# Altium schematic sheet User.SchDoc
size A4
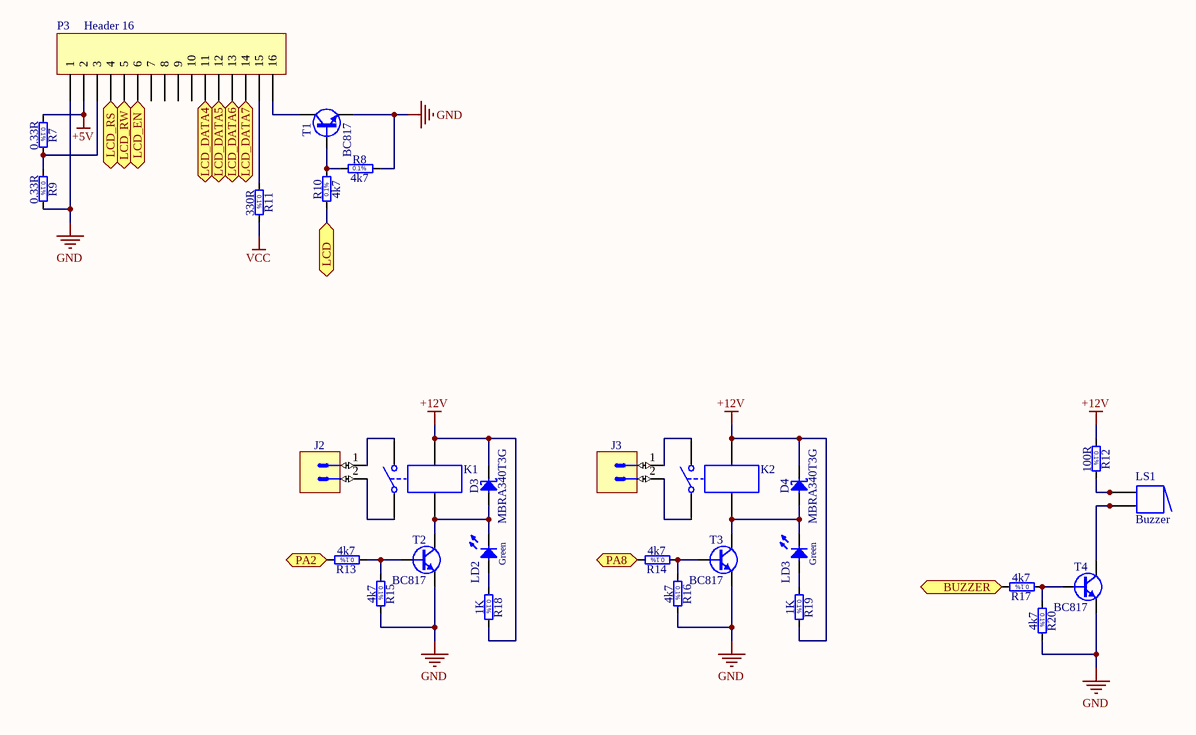
[diagram p0: User.SchDoc]

## Parts
D3  MBRA340T3G  [DIOM5226X220N]
D4  MBRA340T3G  [DIOM5226X220N]
J2  (no value)  [PHOENIX_1757242]
J3  (no value)  [PHOENIX_1757242]
K1  Relay-SPST  [REL_FINDER_32.22.X.XXX.X300]  (value not drawn)
K2  Relay-SPST  [REL_FINDER_32.22.X.XXX.X300]  (value not drawn)
LD2  Green  [LED_OSRAM_LGR971]  (value not drawn)
LD3  Green  [LED_OSRAM_LGR971]  (value not drawn)
LS1  Buzzer  [ABSM-1574]
P3  Header 16  [HDR1X16]
R7  0.33R  [RESC2012X60N]
R8  4k7  [RESC2012X60N]
R9  0.33R  [RESC2012X60N]
R10  4k7  [RESC2012X60N]
R11  330R  [RESC2012X60N]
R12  100R  [RESC2012X60N]
R13  4k7  [RESC2012X60N]
R14  4k7  [RESC2012X60N]
R15  4k7  [RESC2012X60N]
R16  4k7  [RESC2012X60N]
R17  4k7  [RESC2012X60N]
R18  1K  [RESC2012X60N]
R19  1K  [RESC2012X60N]
R20  4k7  [RESC2012X60N]
T1  BC817  [SOT95P230X110-3N]
T2  BC817  [SOT95P230X110-3N]
T3  BC817  [SOT95P230X110-3N]
T4  BC817  [SOT95P230X110-3N]

## Ports
BUZZER, LCD, LCD_DATA4, LCD_DATA5, LCD_DATA6, LCD_DATA7, LCD_EN, LCD_RS, LCD_RW, PA2, PA8

## Nets
+5V: P3.2 R7.1
+12V: D3.1(C) D4.1(C) K1.4 K2.4 R12.1 R18.2 R19.2
GND: P3.1 R8.2 R9.2 R15.2 R16.2 R20.2 T1.2(E) T2.2(E) T3.2(E) T4.2(E)
VCC: R11.2
BUZZER: R17.2 ; port BUZZER
LCD: R10.1 ; port LCD
LCD_DATA4: P3.11 ; port LCD_DATA4
LCD_DATA5: P3.12 ; port LCD_DATA5
LCD_DATA6: P3.13 ; port LCD_DATA6
LCD_DATA7: P3.14 ; port LCD_DATA7
LCD_EN: P3.6 ; port LCD_EN
LCD_RS: P3.4 ; port LCD_RS
LCD_RW: P3.5 ; port LCD_RW
PA2: R13.2 ; port PA2
PA8: R14.2 ; port PA8
NetD3_2: D3.2(A) K1.3 LD2.1(C) T2.3(C)
NetD4_2: D4.2(A) K2.3 LD3.1(C) T3.3(C)
NetJ2_1: J2.1 K1.2
NetJ2_2: J2.2 K1.1
NetJ3_1: J3.1 K2.2
NetJ3_2: J3.2 K2.1
NetLD2_2: LD2.2(A) R18.1
NetLD3_2: LD3.2(A) R19.1
NetLS1_1: LS1.1 LS1.1A R12.2
NetLS1_2: LS1.2 LS1.2A T4.3(C)
NetP3_3: P3.3 R7.2 R9.1
NetP3_15: P3.15 R11.1
NetP3_16: P3.16 T1.3(C)
NetR8_1: R8.1 R10.2 T1.1(B)
NetR13_1: R13.1 R15.1 T2.1(B)
NetR14_1: R14.1 R16.1 T3.1(B)
NetR17_1: R17.1 R20.1 T4.1(B)

Not connected (* = marked no-connect by the designer): P3 7 8 9 10

## Notes on the sheet
- (in symbol R0805_1K1_0.1%_0.1W_10PPM) 0.1%

## Library data of the parts
D3 D4 = MBRA340T3G: Schottky Diode; Part Description: Schottky Power Rectifier; Manufacturer: ON SEMICONDUCTOR; Voltage: 40V; Power: 3A; Table: Diodes; Part Number: MBRA340T3G; Component Kind: Standard; Component Type: Standard; Device: MBRA340T3G; PackageDescription: DO-214-AC/SMA Diode, Molded Body; 5.21mm L X 2.60mm W X 2.20mm H, IPC Medium Density; Manufacturer Part Number: MBRA340T3G; Pin Count: 2; Case: DO-214AC; Mounted: Yes; Socket: No; SMD: Yes; ComponentHeight: 2.2mm; HelpURL: \\cern.ch\dfs\Applications\Altium\Datasheets\MBRA340T3G.pdf; Author: CERN DEM JLC; CreateDate: 18.06.2012; LatestRevisionDate: 18.06.2012
J2 J3 = PHOENIX_1757242: Connector 2 Male; Part Description: 12A, 250V, Pitch 5.08mm, 2 Positions Header; Manufacturer: PHOENIX CONTACT; Manufacturer Part Number: 1757242 (MSTBA 2,5/ 2-G-5,08); Part Number: PHOENIX_1757242; Component Kind: Standard; Component Type: Standard; Pin Count: 2; Mounted: Yes; Socket: No; SMD: No; Status: None; ComponentHeight: 8.6mm; HelpURL: \\cern.ch\dfs\Applications\Altium\Datasheets\PHOENIX_1757242.pdf; Author: CERN DEM JLC; CreateDate: 10.02.2010; LatestRevisionDate: 26.04.2010; Table: PHOENIX
K1 K2 = Relay-SPST: Single-Pole Single-Throw Relay; pin to pad: 1>11 2>14 3>A1 4>A2; Published: 24-Mar-1999; LatestRevisionDate: 17-Jul-2002; LatestRevisionNote: Re-released for DXP Platform.; PackageReference: MODULE4; Publisher: Altium Limited
LD2 LD3 = LED_OSRAM_LGR971: LED Green 1C 2A; Part Description: Surface Mount Green LED (0805 Case); Manufacturer: OSRAM; Manufacturer Part Number: LGR971; Table: LEDs & Displays; Part Number: LED_OSRAM_LGR971; Component Kind: Standard; Component Type: Standard; Color: Green; PackageDescription: Green Chip LED, 2-Leads, Body 2.0x1.25mm, IPC Medium Density; Pin Count: 2; Case: 0805; Mounted: Yes; Socket: No; SMD: Yes; ComponentHeight: 0.9mm; HelpURL: \\cern.ch\dfs\Applications\Altium\Datasheets\LED_OSRAM_LGR971.pdf; Author: CERN DEM JLC; CreateDate: 28.01.2009; LatestRevisionDate: 17.03.2010
LS1 = Buzzer: Magnetic Transducer Buzzer; Published: 24-Mar-1999; LatestRevisionDate: 17-Dec-2003; LatestRevisionNote: Schematic revised, PCB Footprint replaced.; DatasheetVersion: 17-Dec-2003; PackageReference: ABSM-1574; Publisher: Altium Limited; PackageDescription: Magnetic Transducer Buzzer; ComponentLink1Description: Manufacturer Link; ComponentLink1URL: http://www.megastar.com/linecard/buzzmode/index.php
P3 = Header 16: Header, 16-Pin; LatestRevisionDate: 17-Jul-2002; LatestRevisionNote: Re-released for DXP Platform.; Publisher: Altium Limited
R7-R20 = R0805_1K1_0.1%_0.1W_10PPM: Resistor - 0.1%; Part Description: Thin Film Chip Resistor; Manufacturer: GENERIC; Manufacturer1 Part Number: RN73C2A1K1BTG; Power: 0.1W; TC: ±10ppm; Table: Resistors SMD; Part Number: R0805_1K1_0.1%_0.1W_10PPM; Component Kind: Standard; Component Type: Standard; Pin Count: 2; Status: Not recommended; Tolerance: ±0.1%; Manufacturer Part Number: R0805_1K1_0.1%_0.1W_10PPM; Case: 0805; Mounted: Yes; Socket: No; SMD: Yes; Manufacturer1 Example: TYCO HOLSWORTHY; Manufacturer1 ComponentHeight: 0.6mm; HelpURL: \\cern.ch\dfs\Applications\Altium\Datasheets\R0805_Tyco_RN73.pdf; Author: CERN DEM JLC; CreateDate: 03.12.2007; LatestRevisionDate: 13.03.2008
  R7 R9: Value: 0.33R
  R8 R10 R13-R17 R20: Value: 4k7
  R11: Value: 330R
  R12: Value: 100R
  R18 R19: Value: 1K
T1-T4 = BC817: NPN Transistor; Part Description: 45V 500mA NPN General-Purpose Transistor; Manufacturer: NXP SEMICONDUCTORS; Table: Transistors; Part Number: BC817; Component Kind: Standard; Component Type: Standard; Device: BC817; PackageDescription: SOT23, 3 pin, Pitch 0.95mm - 1.3mm W X 2.9mm L X 1.1mm H, IPC Medium Density; Manufacturer Part Number: BC817; Pin Count: 3; Case: SOT23-3; Mounted: Yes; Socket: No; SMD: Yes; ComponentHeight: 1.1mm; HelpURL: \\cern.ch\dfs\Applications\Altium\Datasheets\BC817.pdf; Author: CERN DEM JLC; CreateDate: 12.05.2011; LatestRevisionDate: 12.05.2011